# EAGLE design G717 (EAGLE 6.6.0)
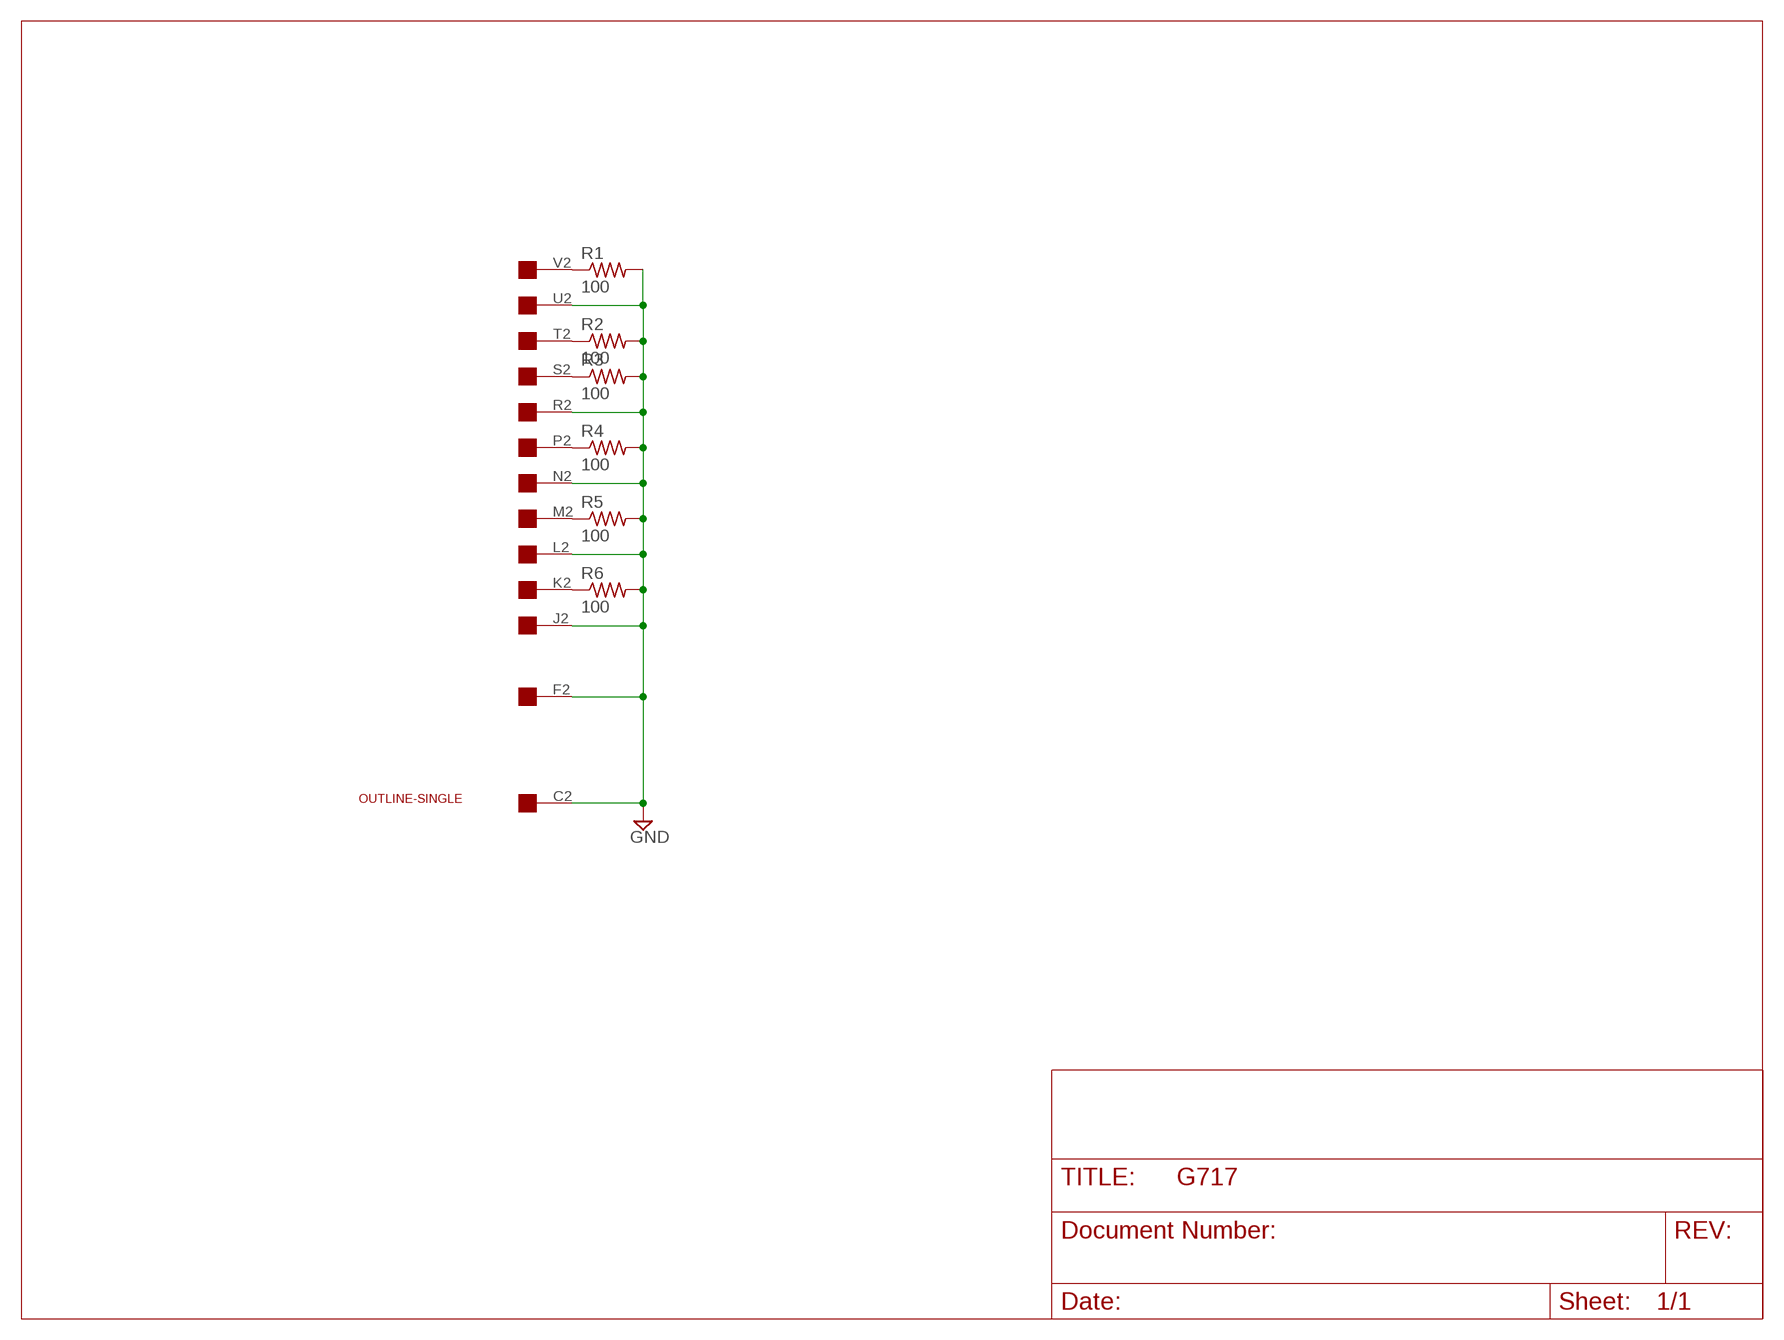
[diagram p0: schematic, sheet 1]

## Parts
R1  100  R-US_0207/10  [0207/10]
R2  100  R-US_0207/10  [0207/10]
R3  100  R-US_0207/10  [0207/10]
R4  100  R-US_0207/10  [0207/10]
R5  100  R-US_0207/10  [0207/10]
R6  100  R-US_0207/10  [0207/10]
U$1  OUTLINE-SINGLE  [SINGLE]
U$3  EDGE-1  [EDGE-CON1]

## Nets
GND [Supply]: R1.2 R2.2 R3.2 R4.2 R5.2 R6.2 U$3.C2 U$3.F2 U$3.J2 U$3.L2 U$3.N2 U$3.R2 U$3.U2
N$1: R1.1 U$3.V2
N$2: R2.1 U$3.T2
N$3: R3.1 U$3.S2
N$4: R4.1 U$3.P2
N$5: R5.1 U$3.M2
N$6: R6.1 U$3.K2
Unconnected: U$3.A2 U$3.B2 U$3.D2 U$3.E2 U$3.H2

## Library data of the parts
R1-R6 = rcl:R-US_: RESISTOR, American symbol
U$1 = dec-con:OUTLINE-*: Board outlines for DEC boards.
U$3 = dec-con:EDGE-1: Single-Sided DEC Edge Connector -- (side 2)

## Net classes
1 Supply: width 0.508 mm, clearance 0.508 mm

## Board
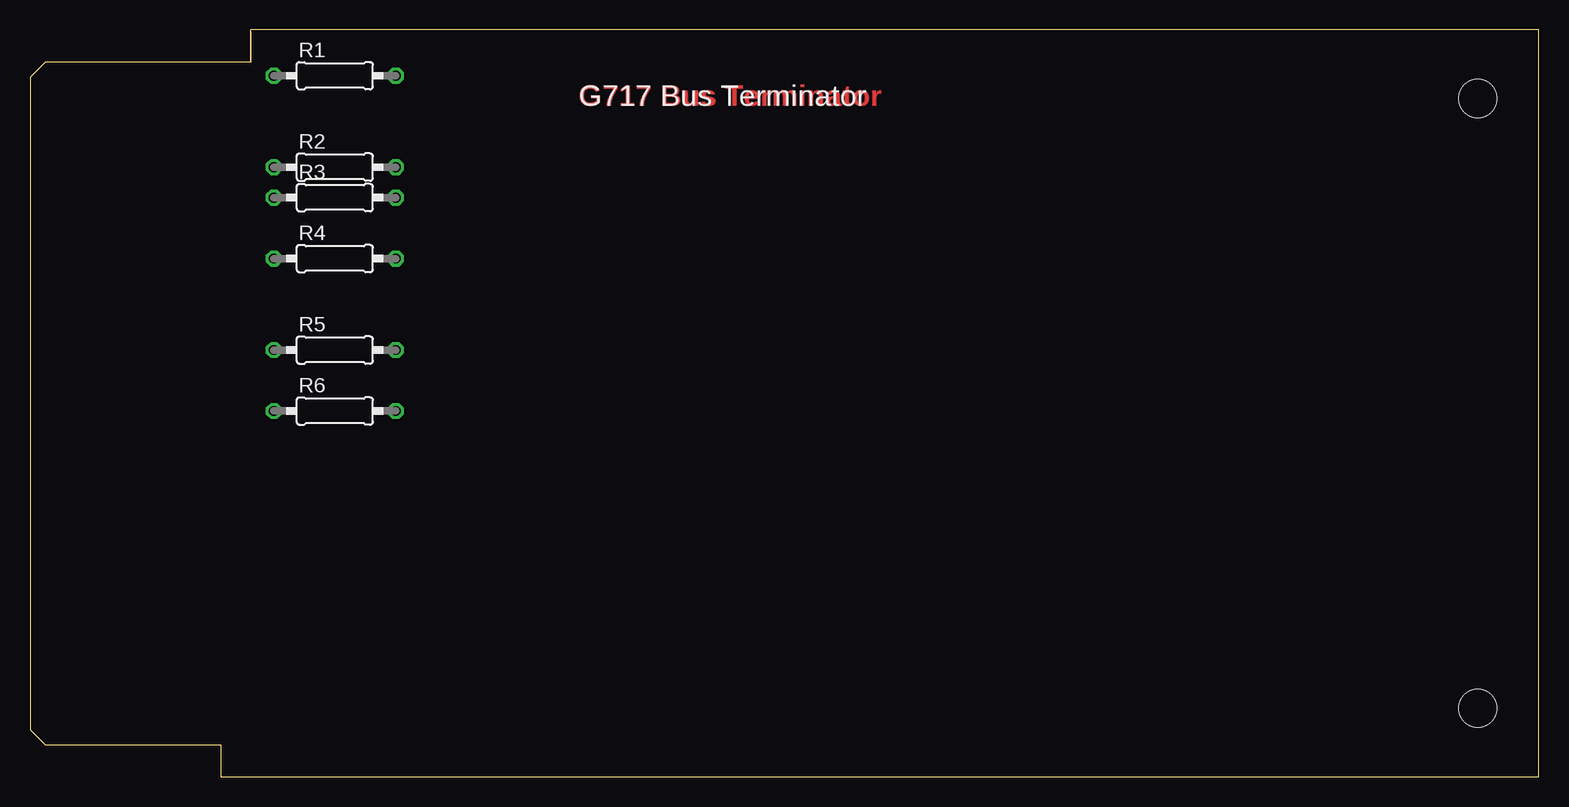
[diagram p1: board, top side]
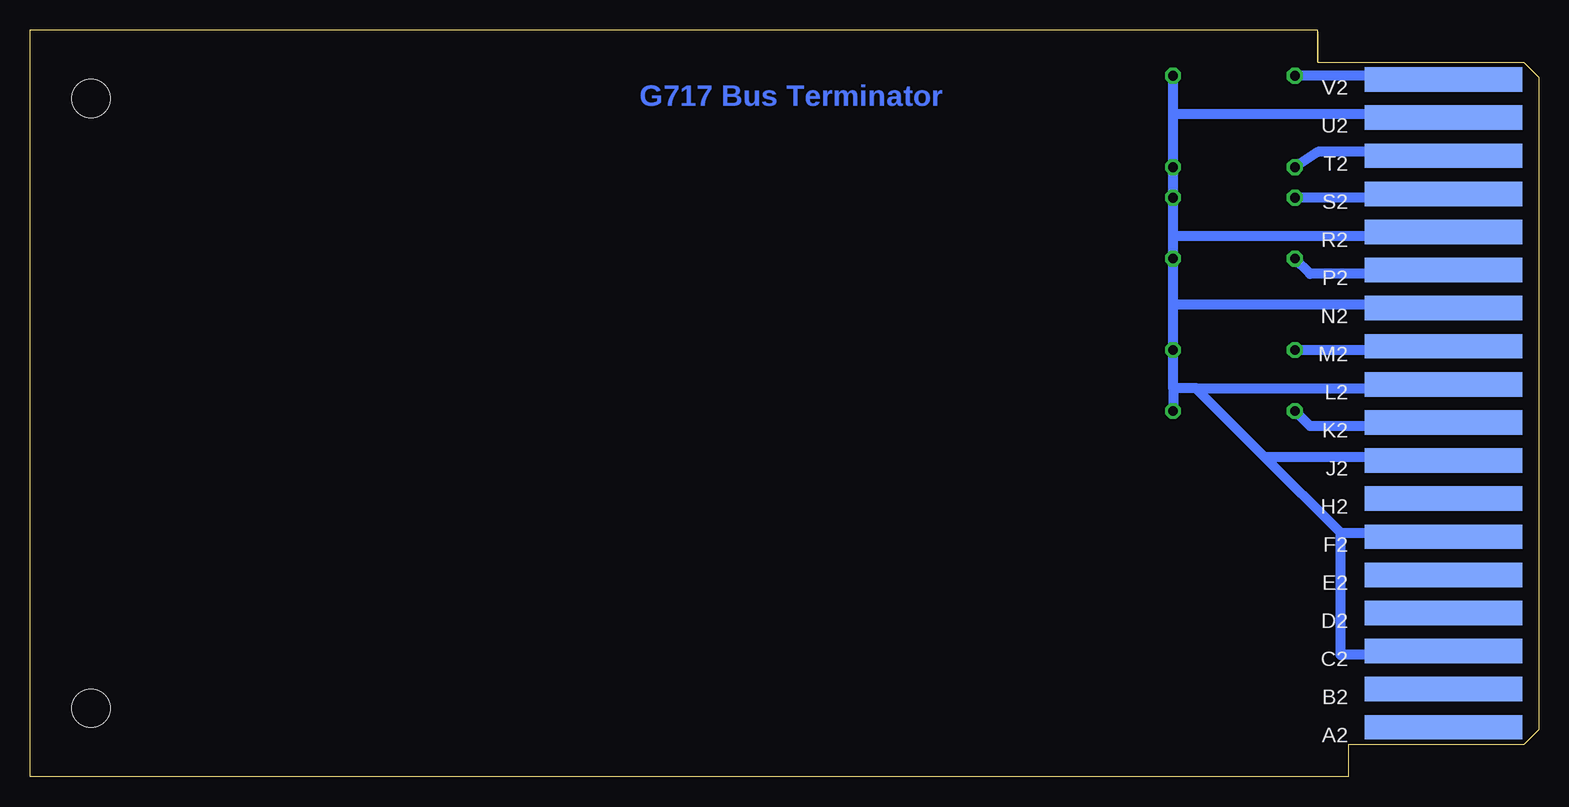
[diagram p2: board, bottom side, seen from below]

Size 125.73 x 62.23 mm. Coordinates in mm from the lower left corner, seen from the top.
Copper layers (1+16): Top 0.035mm / dielectric 1.5mm / Bottom 0.035mm
Design rules "16mils": minimum track width 16mil, minimum drill 32mil, track to track 15mil, track to pad 10mil, pad to pad 10mil, via to via 10mil, smd to smd 10mil, copper to edge 13mil, drill to drill 10mil, minimum pad ring 10mil, minimum via ring 8mil, stop-mask expansion 0mil, vias tented up to drill 0mil, thermal gap 10mil

### Footprints (pad centres in the part's own frame; a part is rotated, then mirrored left to right if it is on the bottom)
0207/10 = drill 0.813 octagon: 1 -5.08,0; 2 5.08,0
SINGLE = hole 3.175: 120.65,56.515; 120.65,5.715
EDGE-CON1 = smd 13.106 x 2.032 bottom: A2 7.938,4.128; B2 7.938,7.303; C2 7.938,10.477; D2 7.938,13.652; E2 7.938,16.828; F2 7.938,20.003; H2 7.938,23.177; J2 7.938,26.352; K2 7.938,29.527; L2 7.938,32.703; M2 7.938,35.877; N2 7.938,39.053; P2 7.938,42.227; R2 7.938,45.403; S2 7.938,48.578; T2 7.938,51.752; U2 7.938,54.928; V2 7.938,58.102

### Placement (x,y rotation side)
R1  25.4,58.42 0 top
R2  25.4,50.8 0 top
R3  25.4,48.26 0 top
R4  25.4,43.18 0 top
R5  25.4,35.56 0 top
R6  25.4,30.48 0 top
U$1  0,0 0 top
U$3  0,0 0 top

### Tracks (layer width: path | path; a pad name or v marks a point on that pad's centre or on a via)
GND
  Bottom 0.813: 30.48,32.38 R5.2 30.48,39.37 | 30.48,32.38 R6.2 | 30.48,45.09 R3.2 R2.2 30.48,55.24 | 30.48,45.09 R4.2 30.48,39.37 | 30.48,55.24 R1.2 | 28.58,32.38 13.97,32.38 U$3.L2 | 28.58,32.38 30.48,32.38 | 22.86,26.67 28.58,32.38 | 16.51,20.32 22.86,26.67 | 16.51,20.32 13.97,20.32 U$3.F2 | 16.51,20.32 16.51,10.16 13.97,10.16 U$3.C2 | 22.86,26.67 13.97,26.67 U$3.J2 | 30.48,45.09 13.97,45.09 U$3.R2 | 30.48,39.37 13.97,39.37 U$3.N2 | 30.48,55.24 13.97,55.24 U$3.U2
N$1
  Bottom 0.813: R1.1 19.69,58.42 13.97,58.42 U$3.V2
N$2
  Bottom 0.813: R2.1 18.42,52.07 13.97,52.07 U$3.T2
N$3
  Bottom 0.813: R3.1 19.69,48.26 13.97,48.26 U$3.S2
N$4
  Bottom 0.813: R4.1 19.05,41.91 13.97,41.91 U$3.P2
N$5
  Bottom 0.813: R5.1 19.69,35.56 13.97,35.56 U$3.M2
N$6
  Bottom 0.813: R6.1 19.05,29.21 13.97,29.21 U$3.K2

### Text on the board
Top: G717 Bus Terminator
Bottom: G717 Bus Terminator
tNames: G717 Bus Terminator